# Altium schematic sheet Elevator switch Panel Schematic-Altium (1).SchDoc
size A3
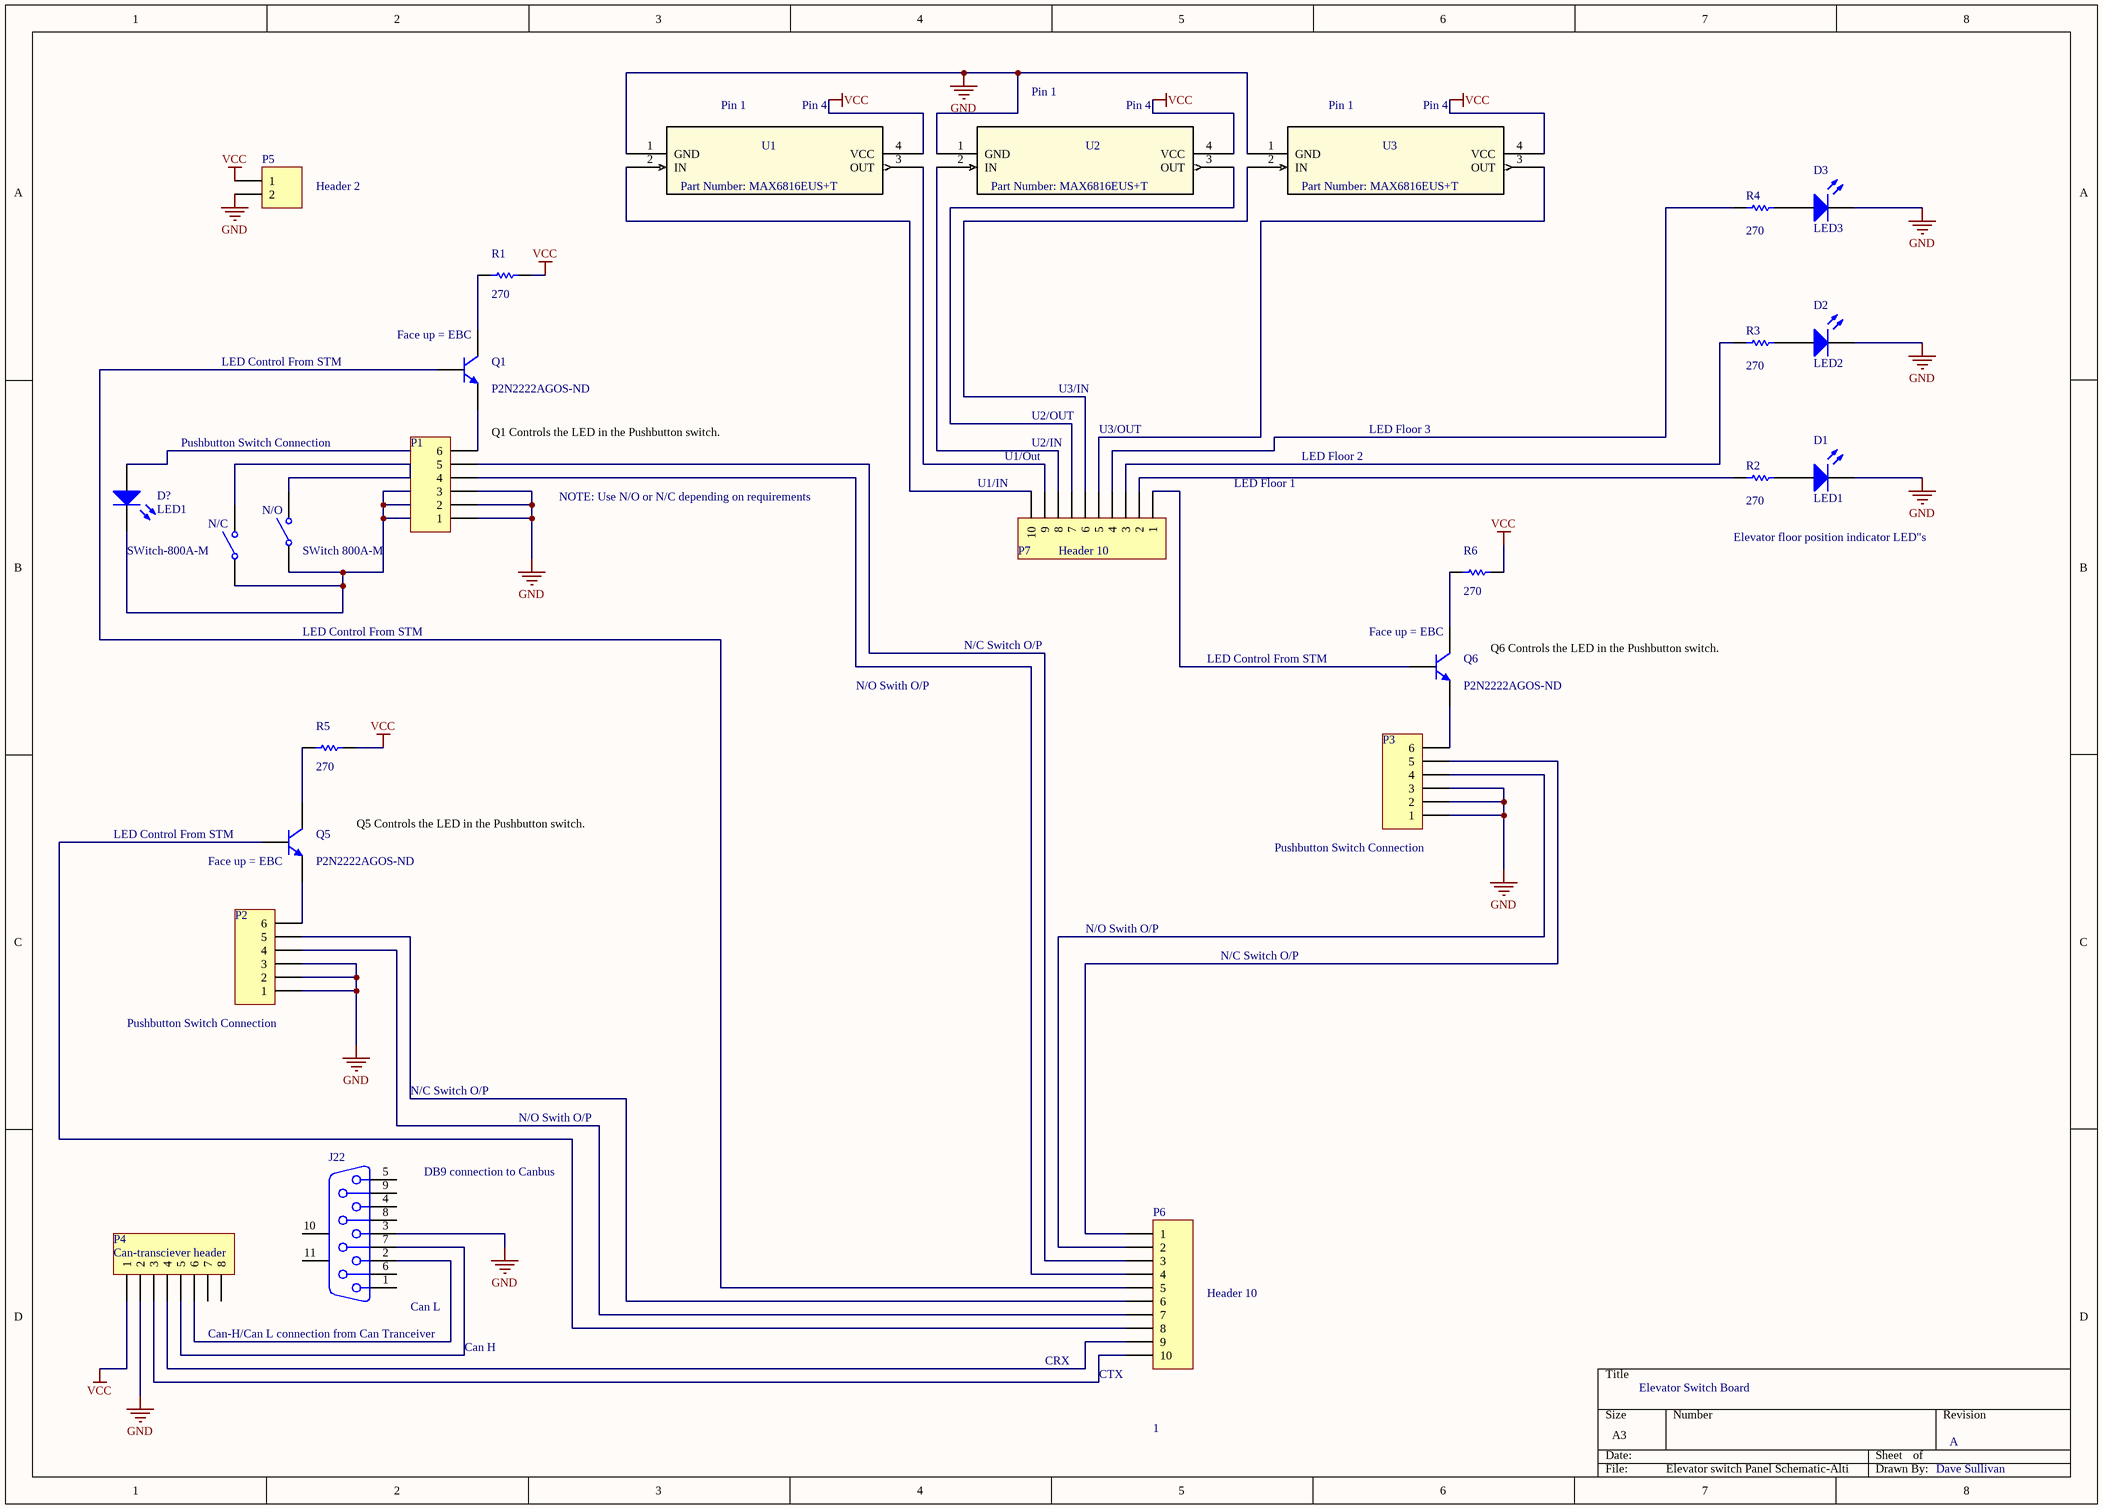
[diagram p0: Elevator switch Panel Schematic-Altium (1).SchDoc]

## Parts
D1  LED1  [LED-1]
D2  LED2  [LED-1]
D3  LED3  [LED-1]
D?  LED1  [LED-1]
J22  (no value)  [DSUB1.385-2H9]
N/C  SWitch 800A-M  [SPST-2]
N/O  SWitch-800A-M  [SPST-2]
P1  Pushbutton Switch Connection  [HDR1X6]
P2  Pushbutton Switch Connection  [HDR1X6]
P3  Pushbutton Switch Connection  [HDR1X6]
P4  Can-transciever header  [HDR1X8]
P5  Header 2  [HDR1X2]
P6  Header 10  [HDR1X10]
P7  Header 10  [HDR1X10]
Q1  P2N2222AGOS-ND  [TO-92A]
Q5  P2N2222AGOS-ND  [TO-92A]
Q6  P2N2222AGOS-ND  [TO-92A]
R1  value 270  [AXIAL-0.3]
R2  value 270  [AXIAL-0.3]
R3  value 270  [AXIAL-0.3]
R4  value 270  [AXIAL-0.3]
R5  value 270  [AXIAL-0.3]
R6  value 270  [AXIAL-0.3]
U1  Part Number: MAX6816EUS+T  [21-0052F]
U2  Part Number: MAX6816EUS+T  [21-0052F]
U3  Part Number: MAX6816EUS+T  [21-0052F]

## Nets
GND: D1.2(K) D2.2(K) D3.2(K) J22.3 P1.1 P1.2 P1.3 P2.1 P2.2 P2.3 P3.1 P3.2 P3.3 P4.2 P5.2 U1.1(GND) U2.1(GND) U3.1(GND)
VCC: P4.1 P5.1 R1.2 R5.2 R6.2 U1.4(VCC) U2.4(VCC) U3.4(VCC)
NetD1_1: D1.1(A) R2.1
NetD2_1: D2.1(A) R3.1
NetD3_1: D3.1(A) R4.1
NetD?_2: D?.2(K) N/C.1(COMMON) N/O.1(COMMON)
NetJ22_2: J22.2 P4.6
NetJ22_7: J22.7 P4.5
NetN/C_2: N/C.2(NO) N/O.2(NO)
NetP1_4: P1.4 P6.4
NetP1_5: P1.5 P6.3
NetP1_6: P1.6 Q1.1(E)
NetP2_4: P2.4 P6.7
NetP2_5: P2.5 P6.6
NetP2_6: P2.6 Q5.1(E)
NetP3_4: P3.4 P6.2
NetP3_5: P3.5 P6.1
NetP3_6: P3.6 Q6.1(E)
NetP4_3: P4.3 P6.10
NetP4_4: P4.4 P6.9
NetP6_5: P6.5 Q1.2(B)
NetP6_8: P6.8 Q5.2(B)
NetP7_1: P7.1 Q6.2(B)
NetP7_2: P7.2 R2.2
NetP7_3: P7.3 R3.2
NetP7_4: P7.4 R4.2
NetP7_5: P7.5 U3.3(OUT)
NetP7_6: P7.6 U3.2(IN)
NetP7_7: P7.7 U2.3(OUT)
NetP7_8: P7.8 U2.2(IN)
NetP7_9: P7.9 U1.3(OUT)
NetP7_10: P7.10 U1.2(IN)
NetQ1_3: Q1.3(C) R1.1
NetQ5_3: Q5.3(C) R5.1
NetQ6_3: Q6.3(C) R6.1

Not connected (* = marked no-connect by the designer): D? 1(A); J22 1 4 5 6 8 9 10(MH1) 11(MH2); P4 7 8

## Notes on the sheet
- (near U1) Pin 1
- (near U1) Pin 4
- Pin 1
- (near U2) Pin 4
- (near U3) Pin 1
- (near U3) Pin 4
- LED Control From STM
- (near Q1) Face up = EBC
- Q1 Controls the LED in the Pushbutton switch.
- U2/IN
- U2/OUT
- U3/IN
- U3/OUT
- LED Floor 3
- NOTE: Use N/O or N/C depending on requirements
- (near P7) U1/IN
- U1/Out
- LED Floor 1
- LED Floor 2
- Elevator floor position indicator LED"s
- N/C Switch O/P
- (near Q6) Face up = EBC
- N/O Swith O/P
- (near Q6) Q6 Controls the LED in the Pushbutton switch.
- Q5 Controls the LED in the Pushbutton switch.
- (near Q5) Face up = EBC
- DB9 connection to Canbus
- (near J22) Can L
- Can-H/Can L connection from Can Tranceiver
- Can H
- CRX
- (near P6) CTX
- Elevator Switch Board
- 1
- A
- Dave Sullivan

## Library data of the parts
D1-D3 D? = LED1: Typical RED GaAs LED; Published: 8-Jun-2000; LatestRevisionDate: 08-Jul-2005; LatestRevisionNote: Mech Layer 1 removed.; PackageReference: LED-1; Publisher: Altium Limited; PackageDescription: LED; 2 Leads
J22 = D Connector 9: Receptacle Assembly, 9 Position, Right Angle; PackageDocument: O; Positions: 9; Published: 15-Jun-2001; LatestRevisionDate: 17-Jul-2002; LatestRevisionNote: Re-released for DXP Platform.; DatasheetDocument: 1-Sep-1999; PackageReference: 788750; Publisher: Altium Limited; Orientation: Right Angle; Gender: Receptacle
N/C N/O = SW-SPST: Single-Pole, Single-Throw Switch; Published: 24-Mar-1999; LatestRevisionDate: 17-Jul-2002; LatestRevisionNote: Re-released for DXP Platform.; PackageReference: SPST-2; Publisher: Altium Limited; PackageDescription: Switch; 2 Leads
P1-P3 = Header 6: Header, 6-Pin; LatestRevisionDate: 17-Jul-2002; LatestRevisionNote: Re-released for DXP Platform.; Publisher: Altium Limited
P4 = Header 8: Header, 8-Pin; LatestRevisionDate: 17-Jul-2002; LatestRevisionNote: Re-released for DXP Platform.; Publisher: Altium Limited
P5 = Header 2: input power and ground; LatestRevisionDate: 17-Jul-2002; LatestRevisionNote: Re-released for DXP Platform.; Publisher: Altium Limited
P6 P7 = Header 10: Header, 10-Pin; LatestRevisionDate: 17-Jul-2002; LatestRevisionNote: Re-released for DXP Platform.; Publisher: Altium Limited
Q1 Q5 Q6 = 2N3904: NPN General Purpose Amplifier; Published: 8-Jun-2000; LatestRevisionDate: 15-Jan-2003; LatestRevisionNote: PCB Footprint 'BCY-W3/D4.7' replaced; DatasheetVersion: 1997; PackageVersion: Sep-1998; PackageReference: TO-92A; Publisher: Altium Limited; PackageDescription: TO, Flat Index; 3 In-Line, Axial Leads; Body Dia. 4.5mm; Leads 0.51 x 0.48 mm (max); ComponentLink1Description: Manufacturer Link; ComponentLink1URL: http://www.fairchildsemi.com/; ComponentLink2Description: Datasheet; ComponentLink2URL: http://www.fairchildsemi.com/ds/2N%2F2N3904.pdf
R1-R6 = Res1: Resistor; Published: 8-Jun-2000; LatestRevisionDate: 17-Jul-2002; LatestRevisionNote: Re-released for DXP Platform.; PackageReference: AXIAL-0.3; Publisher: Altium Limited; PackageDescription: Axial Device, Thru-Hole; 2 Leads; 0.3 in Pin Spacing
U1-U3 = MAX6816EUS+T: No Description Available; Vendor: Maxim Integrated Products; Built_By: EMA_UL_Team; Manufacturer_Part_Number: MAX6816EUS+T; Copyright: Copyright (C) 2018 Accelerated Designs. All rights reserved; RefDes: RefDes; Type: DEV; Value: Value